# EAGLE design CC1-32KEC-0001.1 (EAGLE 5.04)
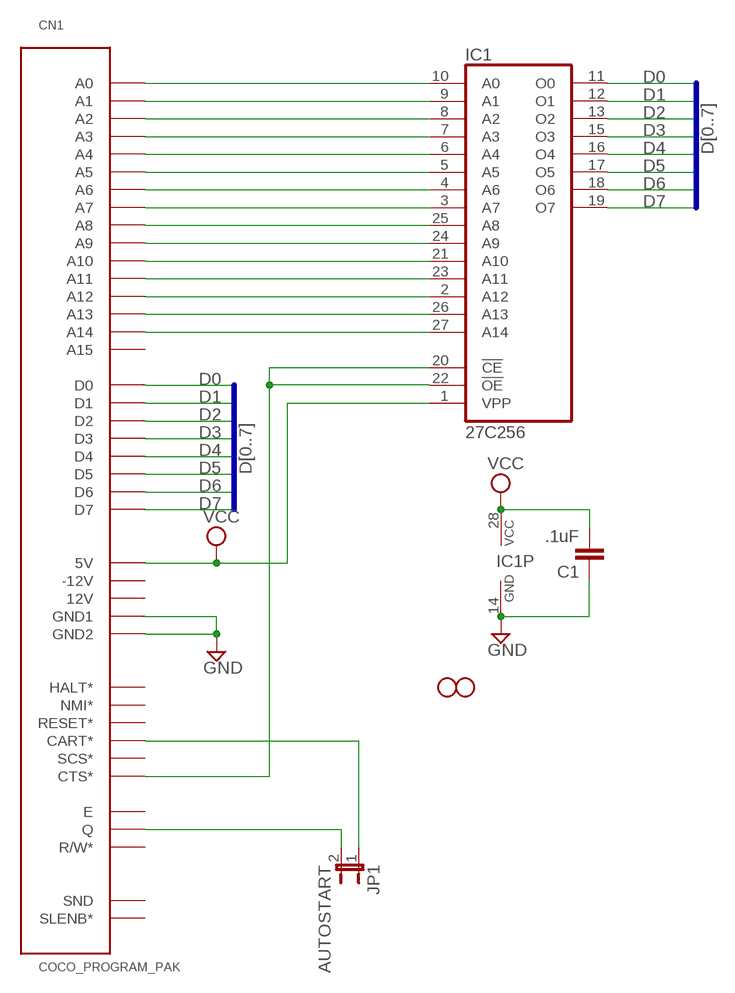
[diagram p0: schematic, sheet 1]

## Parts
C1  .1uF  CAPPTH2  [CAP-PTH-SMALL2]
CN1  COCO_PROGRAM_PAK  [COCO_EDGECARD40]
IC1  27C256  27256  [DIL28]
JP1  AUTOSTART  JP1E  [JP1]
U$2  SPARKFUN_STAND-OFF  [SPARKFUN_STAND-OFF]
U$3  SPARKFUN_STAND-OFF  [SPARKFUN_STAND-OFF]

## Nets
D0: CN1.D0 IC1.11(O0)
D1: CN1.D1 IC1.12(O1)
D2: CN1.D2 IC1.13(O2)
D3: CN1.D3 IC1.15(O3)
D4: CN1.D4 IC1.16(O4)
D5: CN1.D5 IC1.17(O5)
D6: CN1.D6 IC1.18(O6)
D7: CN1.D7 IC1.19(O7)
GND [power]: C1.1 CN1.GND1 CN1.GND2 IC1.14(GND)
N$1: CN1.A0 IC1.10(A0)
N$2: CN1.A1 IC1.9(A1)
N$3: CN1.A2 IC1.8(A2)
N$4: CN1.A3 IC1.7(A3)
N$5: CN1.A4 IC1.6(A4)
N$6: CN1.A5 IC1.5(A5)
N$7: CN1.A6 IC1.4(A6)
N$8: CN1.A7 IC1.3(A7)
N$9: CN1.A8 IC1.25(A8)
N$10: CN1.A9 IC1.24(A9)
N$11: CN1.A10 IC1.21(A10)
N$12: CN1.A11 IC1.23(A11)
N$13: CN1.A12 IC1.2(A12)
N$14: CN1.CTS* IC1.20(!CE) IC1.22(!OE)
N$15: CN1.Q JP1.2
N$16: CN1.CART* JP1.1
N$17: CN1.A13 IC1.26(A13)
N$18: CN1.A14 IC1.27(A14)
VCC [power]: C1.2 CN1.5V IC1.1(VPP) IC1.28(VCC)
Unconnected: CN1.12V CN1.-12V CN1.A15 CN1.E CN1.HALT* CN1.NMI* CN1.R/W* CN1.RESET* CN1.SCS* CN1.SLENB* CN1.SND

## Buses
D[0..7]

## Library data of the parts
C1 = SparkFunEagle-6-6-07:CAP: Capacitor Standard 0603 ceramic capacitor, and 0.1" leaded capacitor.
CN1 = CoCo:COCO_PROGRAM_PAK: CoCo Program Pak
IC1 = memory:27256: MEMORY
JP1 = jumper:JP1E: JUMPER
U$2 U$3 = FDC:SPARKFUN_STAND-OFF: Stand Off This is the mechanical footprint for a #4 phillips button head screw. Use the keepout ring to avoid running the screw head into surrounding components. SKU : PRT-00447

## Net classes
0 default: width 0.203 mm, clearance 0.203 mm
1 power: width 0.762 mm, clearance 0.381 mm

## Board
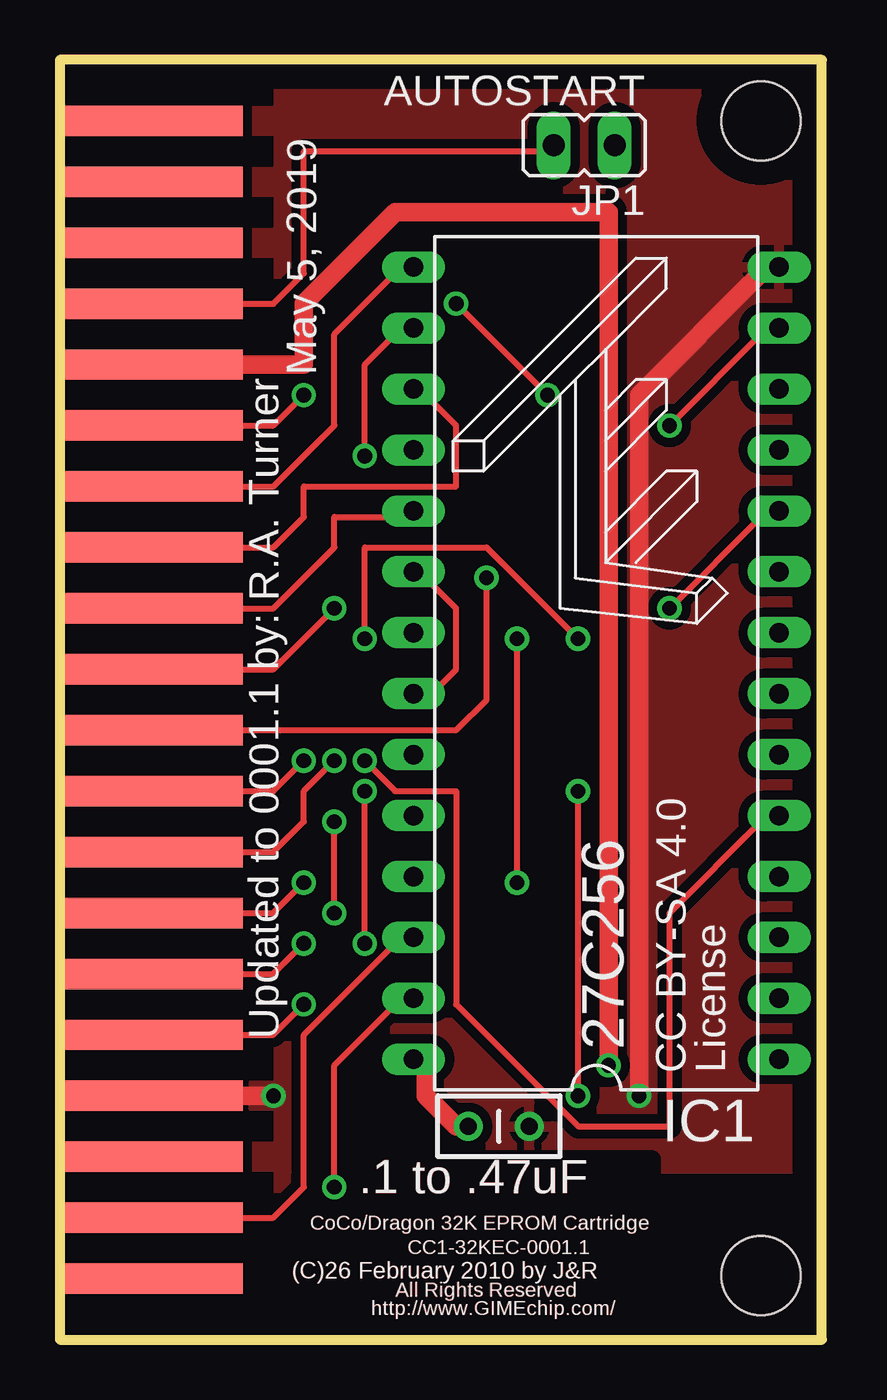
[diagram p1: board, top side]
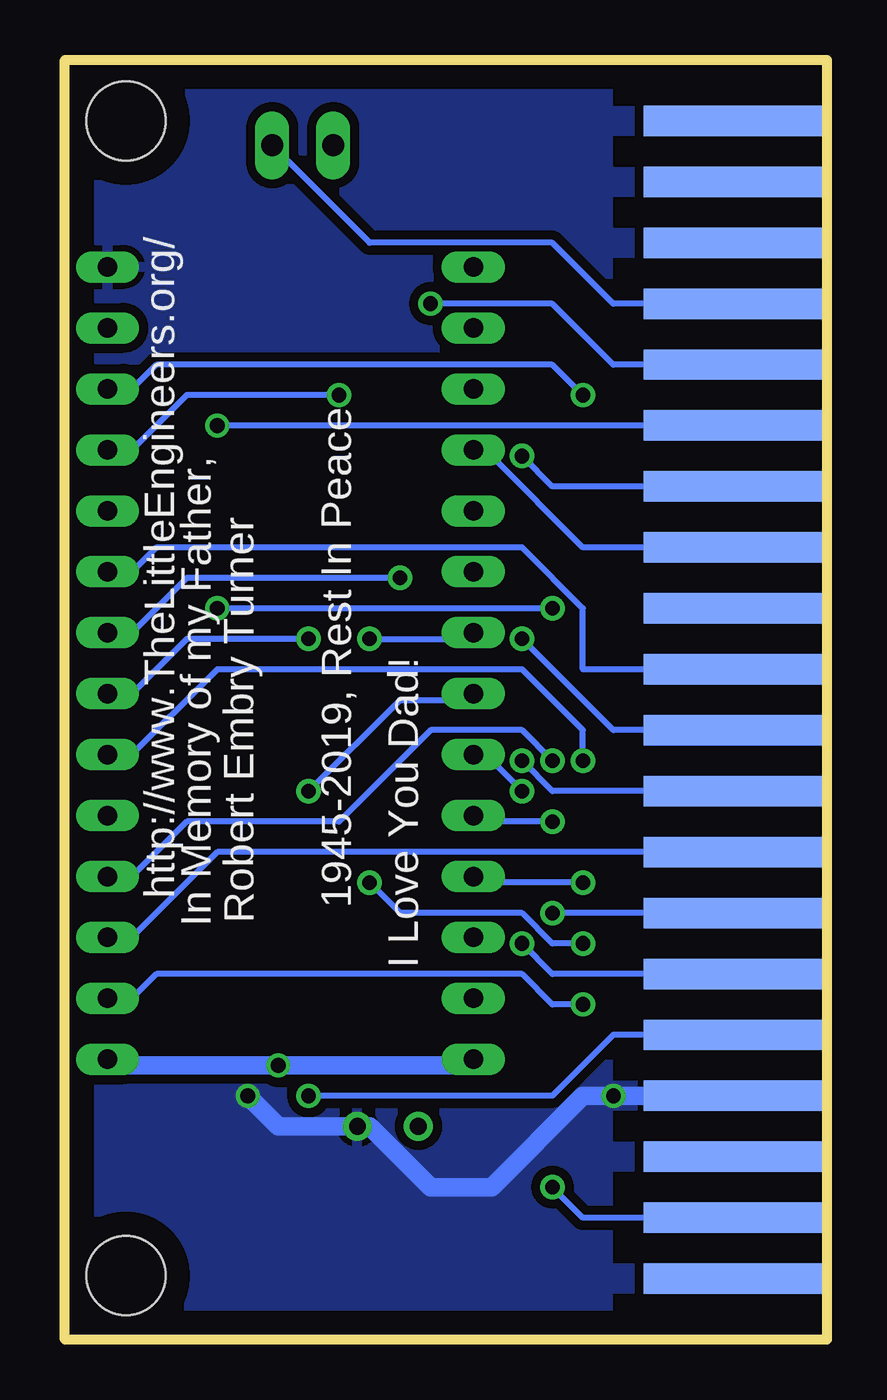
[diagram p2: board, bottom side, seen from below]

Size 31.75 x 53.34 mm. Coordinates in mm from the lower left corner, seen from the top.
Outline: 0,53.34 0,0 31.75,0 31.75,53.34 0,53.34
Copper layers (1*16): Top 0.035mm / dielectric 1.5mm / Bottom 0.035mm
Design rules "default": minimum track width 10mil, minimum drill 24mil, track to track 8mil, track to pad 8mil, pad to pad 8mil, via to via 8mil, smd to smd 8mil, copper to edge 40mil, drill to drill 8mil, minimum pad ring 10mil, minimum via ring 8mil, stop-mask expansion 4mil, vias tented up to drill 0mil, thermal gap 10mil

### Footprints (pad centres in the part's own frame; a part is rotated, then mirrored left to right if it is on the bottom)
CAP-PTH-SMALL2 = drill 0.7 round: 1 0,0; 2 2.54,0
COCO_EDGECARD40 = smd 7.62 x 1.27: 5V 0,13.97; -12V 0,24.13; A0 0,1.27; A2 0,-1.27; A4 0,-3.81; A6 0,-6.35; A8 0,-8.89; A10 0,-11.43; A12 0,-13.97; A13 0,-21.59; A15 0,-24.13; D1 0,11.43; D3 0,8.89; D5 0,6.35; D7 0,3.81; GND1 0,-16.51; HALT* 0,21.59; Q 0,16.51; RESET* 0,19.05; SND 0,-19.05 | smd 7.62 x 1.27 bottom: 12V 0,24.13; A1 0,1.27; A3 0,-1.27; A5 0,-3.81; A7 0,-6.35; A9 0,-8.89; A11 0,-11.43; A14 0,-21.59; CART* 0,16.51; CTS* 0,-13.97; D0 0,13.97; D2 0,11.43; D4 0,8.89; D6 0,6.35; E 0,19.05; GND2 0,-16.51; NMI* 0,21.59; R/W* 0,3.81; SCS* 0,-19.05; SLENB* 0,-24.13
DIL28 = drill 0.813 long: 1 -16.51,-7.62; 2 -13.97,-7.62; 3 -11.43,-7.62; 4 -8.89,-7.62; 5 -6.35,-7.62; 6 -3.81,-7.62; 7 -1.27,-7.62; 8 1.27,-7.62; 9 3.81,-7.62; 10 6.35,-7.62; 11 8.89,-7.62; 12 11.43,-7.62; 13 13.97,-7.62; 14 16.51,-7.62; 15 16.51,7.62; 16 13.97,7.62; 17 11.43,7.62; 18 8.89,7.62; 19 6.35,7.62; 20 3.81,7.62; 21 1.27,7.62; 22 -1.27,7.62; 23 -3.81,7.62; 24 -6.35,7.62; 25 -8.89,7.62; 26 -11.43,7.62; 27 -13.97,7.62; 28 -16.51,7.62
JP1 = drill 0.914 long: 1 0,-1.27; 2 0,1.27
SPARKFUN_STAND-OFF = hole 3.302: 0,0

### Placement (x,y rotation side)
C1  19.56,8.89 180 top
CN1  3.81,26.67 0 top
IC1  22.35,28.19 90 top
JP1  21.84,49.78 90 top
U$1  [TLE-LOGO-13]  20.83,30.48 0 top
U$2  29.21,50.8 0 top
U$3  29.21,2.67 0 top

### Tracks (layer width: path | path; a pad name or v marks a point on that pad's centre or on a via)
D0  (via drill 0.61)
  Top 0.254: v16.51,43.18 v20.32,39.37
  Bottom 0.254: v20.32,39.37 26.67,39.37 29.21,36.83 IC1.11 | v16.51,43.18 11.43,43.18 8.89,40.64 CN1.D0
D1  (via drill 0.61)
  Top 0.254: v10.16,39.37 8.89,38.1 CN1.D1
  Bottom 0.254: v10.16,39.37 11.43,40.64 27.94,40.64 29.21,39.37 IC1.12
D2  (via drill 0.61)
  Top 0.254: v25.4,38.1 29.21,41.91 IC1.13
  Bottom 0.254: CN1.D2 v25.4,38.1
D3
  Top 0.254: IC1.15 13.97,44.45 11.43,41.91 11.43,38.1 8.89,35.56 CN1.D3
D4  (via drill 0.61)
  Top 0.254: v12.7,36.83 12.7,40.64 13.97,41.91 IC1.16
  Bottom 0.254: v12.7,36.83 11.43,35.56 CN1.D4
D5
  Top 0.254: IC1.17 15.24,39.37 16.51,38.1 16.51,35.56 10.16,35.56 10.16,34.29 8.89,33.02 CN1.D5
D6
  Bottom 0.254: IC1.18 13.97,36.83 10.16,33.02 CN1.D6
D7
  Top 0.254: IC1.19 13.97,34.29 11.43,34.29 11.43,33.02 8.89,30.48 CN1.D7
GND  (via drill 0.61)
  Top 0.762: v24.13,10.16 24.13,39.37 29.21,44.45 IC1.14 | v8.89,10.16 CN1.GND2
  Bottom 0.762: CN1.GND2 v8.89,10.16 10.16,10.16 13.97,6.35 16.51,6.35 19.05,8.89 C1.1 22.86,8.89 v24.13,10.16
  pour Top: 0,53.34 31.75,53.34 31.75,7.11 9.4,7.11 9.4,0 0,0
  pour Bottom: 0,53.34 31.75,53.34 31.75,0 0,0
N$1  (via drill 0.61)
  Top 0.254: v25.4,30.48 29.21,34.29 IC1.10 | v11.43,30.48 8.89,27.94 CN1.A0
  Bottom 0.254: v11.43,30.48 v25.4,30.48
N$2
  Bottom 0.254: IC1.9 29.21,31.75 27.94,33.02 12.7,33.02 10.16,30.48 10.16,27.94 CN1.A1
N$3  (via drill 0.61)
  Top 0.254: v17.78,31.75 17.78,26.67 16.51,25.4 CN1.A2
  Bottom 0.254: v17.78,31.75 26.67,31.75 29.21,29.21 IC1.8
N$4  (via drill 0.61)
  Top 0.254: v21.59,29.21 17.78,33.02 12.7,33.02 v12.7,29.21
  Bottom 0.254: v21.59,29.21 26.67,29.21 29.21,26.67 IC1.7 | v12.7,29.21 8.89,25.4 CN1.A3
N$5  (via drill 0.61)
  Top 0.254: v10.16,24.13 8.89,22.86 CN1.A4
  Bottom 0.254: v10.16,24.13 10.16,25.4 12.7,27.94 25.4,27.94 29.21,24.13 IC1.6
N$6  (via drill 0.61)
  Top 0.254: v12.7,24.13 13.97,22.86 16.51,22.86 16.51,13.97 21.59,8.89 25.4,8.89 25.4,17.78 29.21,21.59 IC1.5
  Bottom 0.254: v12.7,24.13 11.43,22.86 CN1.A5
N$7  (via drill 0.61)
  Top 0.254: v11.43,24.13 10.16,22.86 10.16,21.59 8.89,20.32 CN1.A6
  Bottom 0.254: v11.43,24.13 12.7,25.4 16.51,25.4 20.32,21.59 26.67,21.59 29.21,19.05 IC1.4
N$8
  Bottom 0.254: IC1.3 29.21,16.51 25.4,20.32 CN1.A7
N$9  (via drill 0.61)
  Top 0.254: v10.16,19.05 8.89,17.78 CN1.A8
  Bottom 0.254: v10.16,19.05 13.97,19.05 IC1.25
N$10  (via drill 0.61)
  Top 0.254: v11.43,17.78 v11.43,21.59
  Bottom 0.254: v11.43,21.59 13.97,21.59 IC1.24 | CN1.A9 v11.43,17.78
N$11  (via drill 0.61)
  Top 0.254: v19.05,19.05 v19.05,29.21 | v10.16,16.51 8.89,15.24 CN1.A10
  Bottom 0.254: v19.05,29.21 15.24,29.21 IC1.21 | v19.05,19.05 17.78,17.78 12.7,17.78 11.43,16.51 v10.16,16.51
N$12  (via drill 0.61)
  Top 0.254: v12.7,16.51 v12.7,22.86
  Bottom 0.254: v12.7,22.86 13.97,24.13 IC1.23 | v12.7,16.51 11.43,15.24 CN1.A11
N$13  (via drill 0.61)
  Top 0.254: v10.16,13.97 8.89,12.7 CN1.A12
  Bottom 0.254: v10.16,13.97 11.43,13.97 12.7,15.24 27.94,15.24 29.21,13.97 IC1.2
N$14  (via drill 0.61)
  Top 0.254: IC1.22 15.24,26.67 16.51,27.94 16.51,30.48 15.24,31.75 IC1.20 | v21.59,10.16 v21.59,22.86
  Bottom 0.254: v21.59,22.86 17.78,26.67 15.24,26.67 IC1.22 | v21.59,10.16 11.43,10.16 8.89,12.7 CN1.CTS*
N$15
  Top 0.254: JP1.2 20.32,49.53 10.16,49.53 10.16,44.45 8.89,43.18 CN1.Q
N$16
  Bottom 0.254: JP1.1 19.05,45.72 11.43,45.72 8.89,43.18 CN1.CART*
N$17
  Top 0.254: IC1.26 13.97,16.51 10.16,12.7 10.16,6.35 8.89,5.08 CN1.A13
N$18  (via drill 0.61)
  Top 0.254: v11.43,6.35 11.43,11.43 13.97,13.97 IC1.27
  Bottom 0.254: v11.43,6.35 10.16,5.08 CN1.A14
VCC  (via drill 0.61)
  Top 0.762: C1.2 16.51,8.89 15.24,10.16 15.24,11.43 IC1.28 | v22.86,11.43 22.86,46.99 13.97,46.99 10.16,43.18 10.16,40.64 CN1.5V
  Bottom 0.762: IC1.1 29.21,11.43 v22.86,11.43 15.24,11.43 IC1.28

### Text on the board
Top: .1 to .47uF | CoCo/Dragon 32K EPROM Cartridge | CC1-32KEC-0001.1 | (C)26 February 2010 by J&R | http://www.GIMEchip.com/ | All Rights Reserved
tPlace: May 5, 2019 | Updated to 0001.1 by: R.A. Turner | CC BY-SA 4.0 | License | .1 to .47uF | CoCo/Dragon 32K EPROM Cartridge | CC1-32KEC-0001.1 | (C)26 February 2010 by J&R | http://www.GIMEchip.com/ | All Rights Reserved
bPlace: http://www.TheLittleEngineers.org/ | 1945-2019, Rest In Peace | In Memory of my Father, | Robert Embry Turner | I Love You Dad!